# Altium schematic sheet Cherry MX.SchDoc
size 297 x 210 mm
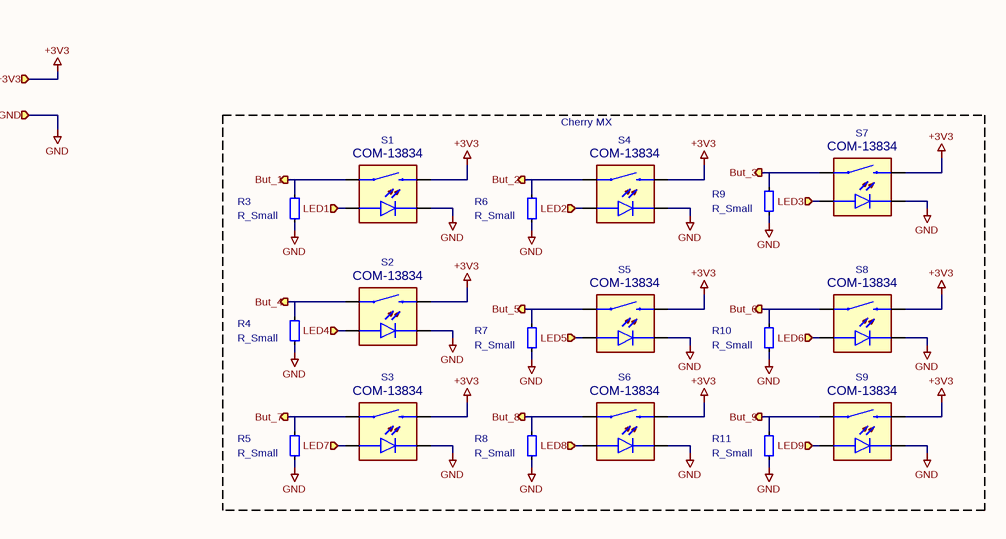
[diagram p0: Cherry MX.SchDoc]

## Parts
R3  R_Small
R4  R_Small
R5  R_Small
R6  R_Small
R7  R_Small  [R_0603_1608Metric]
R8  R_Small
R9  R_Small
R10  R_Small
R11  R_Small
S1  Field4: COM-13834  [CHERRY-MX-LED]  (hidden comment: MOMENTARY-SWITCH-SPST-LED-PTH-CHERRY)
S2  Field4: COM-13834  [CHERRY-MX-LED]  (hidden comment: MOMENTARY-SWITCH-SPST-LED-PTH-CHERRY)
S3  Field4: COM-13834  [CHERRY-MX-LED]  (hidden comment: MOMENTARY-SWITCH-SPST-LED-PTH-CHERRY)
S4  Field4: COM-13834  [CHERRY-MX-LED]  (hidden comment: MOMENTARY-SWITCH-SPST-LED-PTH-CHERRY)
S5  Field4: COM-13834  [CHERRY-MX-LED]  (hidden comment: MOMENTARY-SWITCH-SPST-LED-PTH-CHERRY)
S6  Field4: COM-13834  [CHERRY-MX-LED]  (hidden comment: MOMENTARY-SWITCH-SPST-LED-PTH-CHERRY)
S7  Field4: COM-13834  [CHERRY-MX-LED]  (hidden comment: MOMENTARY-SWITCH-SPST-LED-PTH-CHERRY)
S8  Field4: COM-13834  [CHERRY-MX-LED]  (hidden comment: MOMENTARY-SWITCH-SPST-LED-PTH-CHERRY)
S9  Field4: COM-13834  [CHERRY-MX-LED]  (hidden comment: MOMENTARY-SWITCH-SPST-LED-PTH-CHERRY)

## Blocks framed on the sheet
Cherry MX: R3-R11 S1-S9

## Ports
+3V3 (in), But_1 (out), But_2 (out), But_3 (out), But_4 (out), But_5 (out), But_6 (out), But_7 (out), But_8 (out), But_9 (out), GND (in), LED1 (in), LED2 (in), LED3 (in), LED4 (in), LED5 (in), LED6 (in), LED7 (in), LED8 (in), LED9 (in)

## Nets
+3V3: S1.S2 S2.S2 S3.S2 S4.S2 S5.S2 S6.S2 S7.S2 S8.S2 S9.S2 ; port +3V3
GND: R3.2 R4.2 R5.2 R6.2 R7.2 R8.2 R9.2 R10.2 R11.2 S1.K(C) S2.K(C) S3.K(C) S4.K(C) S5.K(C) S6.K(C) S7.K(C) S8.K(C) S9.K(C) ; port GND
But_1: R3.1 S1.S1 ; port But_1
But_2: R6.1 S4.S1 ; port But_2
But_3: R9.1 S7.S1 ; port But_3
But_4: R4.1 S2.S1 ; port But_4
But_5: R7.1 S5.S1 ; port But_5
But_6: R10.1 S8.S1 ; port But_6
But_7: R5.1 S3.S1 ; port But_7
But_8: R8.1 S6.S1 ; port But_8
But_9: R11.1 S9.S1 ; port But_9
LED1: S1.A ; port LED1
LED2: S4.A ; port LED2
LED3: S7.A ; port LED3
LED4: S2.A ; port LED4
LED5: S5.A ; port LED5
LED6: S8.A ; port LED6
LED7: S3.A ; port LED7
LED8: S6.A ; port LED8
LED9: S9.A ; port LED9

## Notes on the sheet
- 1
- 2
- 3
- 4
- 5
- 6
- A
- B
- C
- D
- Title:
- File: Cherry MX.sch
- Sheet: /
- KiCad E.D.A.  kicad (5.1.4)-1
- Size: A4
- Date:
- Rev:
- Id: 3/4

## Library data of the parts
R3-R11 = R_Small: Value: R_Small
  R7: Footprint: Resistor_SMD:R_0603_1608Metric
S1-S9 = MOMENTARY-SWITCH-SPST-LED-PTH-CHERRY: Value: MOMENTARY-SWITCH-SPST-LED-PTH-CHERRY